# EAGLE design megapci3 (EAGLE 6.6.0)
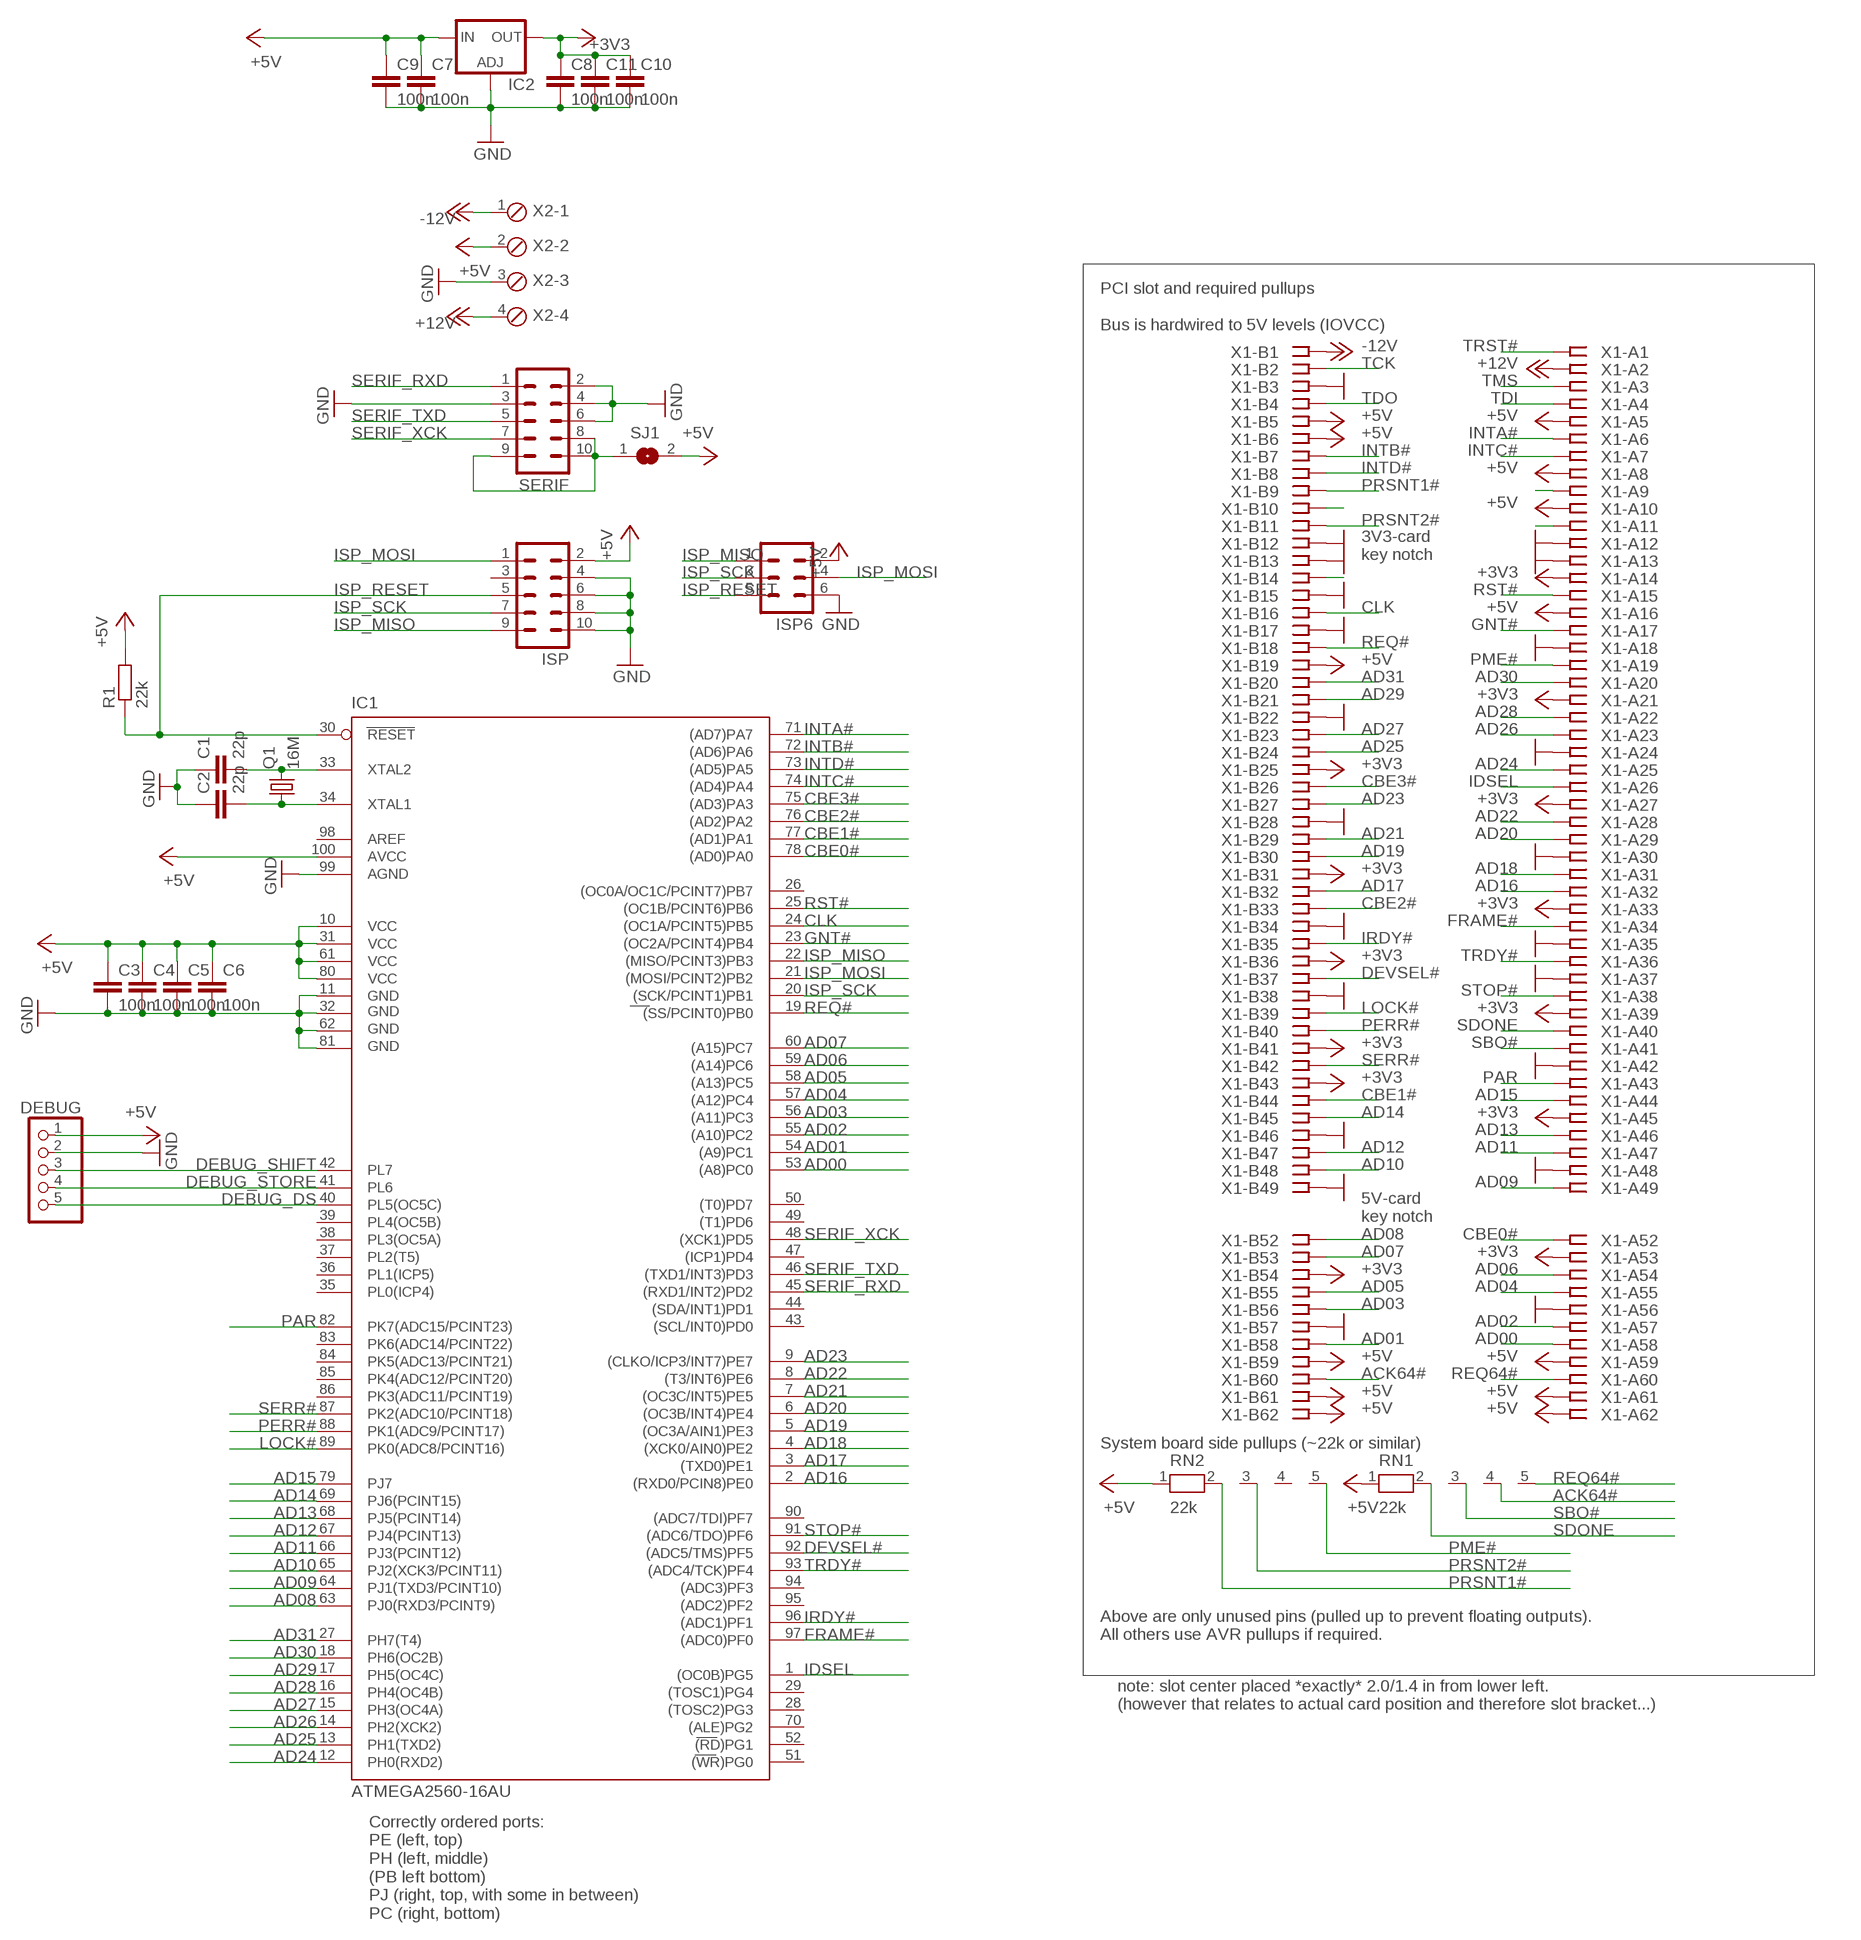
[diagram p0: schematic, sheet 1]

## Parts
C1  22p  C-EUC0805  [C0805]
C2  22p  C-EUC0805  [C0805]
C3  100n  C-EUC0805  [C0805]
C4  100n  C-EUC0805  [C0805]
C5  100n  C-EUC0805  [C0805]
C6  100n  C-EUC0805  [C0805]
C7  100n  C-EUC0805  [C0805]
C8  100n  C-EUC0805  [C0805]
C9  100n  C-EUC0805  [C0805]
C10  100n  C-EUC0805  [C0805]
C11  100n  C-EUC0805  [C0805]
DEBUG  PINHD-1X5  [1X05]
IC1  ATMEGA2560-16AU  [TQFP100]
IC2  LM317TS  [317TS]
ISP  ML10  [ML10]
ISP6  ML6  [ML6]
Q1  16M  CRYSTALHC49S  [HC49/S]
R1  22k  R-EU_R0805  [R0805]
RN1  22k  RN04  [RN-5]
RN2  22k  RN04  [RN-5]
SERIF  ML10  [ML10]
SJ1  SJ  [SJ]
X1  PCI-SLOT  [CON-PCI]
X2  MPT4  [4POL254]

## Nets
5V-SER: SERIF.8 SERIF.9 SERIF.10 SJ1.1
+3V3: C8.1 C10.1 C11.1 IC2.2(OUT) X1.A14 X1.A21 X1.A27 X1.A33 X1.A39 X1.A45 X1.A53 X1.B25 X1.B31 X1.B36 X1.B41 X1.B43 X1.B54
+5V: C3.1 C4.1 C5.1 C6.1 C7.1 C9.1 DEBUG.1 IC1.10(VCC) IC1.31(VCC1) IC1.61(VCC2) IC1.80(VCC3) IC1.100(AVCC) IC2.3(IN) ISP6.2 ISP.2 R1.2 RN1.1 RN2.1 SJ1.2 X1.A5 X1.A8 X1.A10 X1.A16 X1.A59 X1.A61 X1.A62 X1.B5 X1.B6 X1.B19 X1.B59 X1.B61 X1.B62 X2.2
+12V: X1.A2 X2.4
-12V: X1.B1 X2.1
ACK64#: RN1.4 X1.B60
AD00: IC1.53((A8)PC0) X1.A58
AD01: IC1.54((A9)PC1) X1.B58
AD02: IC1.55((A10)PC2) X1.A57
AD03: IC1.56((A11)PC3) X1.B56
AD04: IC1.57((A12)PC4) X1.A55
AD05: IC1.58((A13)PC5) X1.B55
AD06: IC1.59((A14)PC6) X1.A54
AD07: IC1.60((A15)PC7) X1.B53
AD08: IC1.63(PJ0(RXD3/PCINT9)) X1.B52
AD09: IC1.64(PJ1(TXD3/PCINT10)) X1.A49
AD10: IC1.65(PJ2(XCK3/PCINT11)) X1.B48
AD11: IC1.66(PJ3(PCINT12)) X1.A47
AD12: IC1.67(PJ4(PCINT13)) X1.B47
AD13: IC1.68(PJ5(PCINT14)) X1.A46
AD14: IC1.69(PJ6(PCINT15)) X1.B45
AD15: IC1.79(PJ7) X1.A44
AD16: IC1.2((RXD0/PCIN8)PE0) X1.A32
AD17: IC1.3((TXD0)PE1) X1.B32
AD18: IC1.4((XCK0/AIN0)PE2) X1.A31
AD19: IC1.5((OC3A/AIN1)PE3) X1.B30
AD20: IC1.6((OC3B/INT4)PE4) X1.A29
AD21: IC1.7((OC3C/INT5)PE5) X1.B29
AD22: IC1.8((T3/INT6)PE6) X1.A28
AD23: IC1.9((CLKO/ICP3/INT7)PE7) X1.B27
AD24: IC1.12(PH0(RXD2)) X1.A25
AD25: IC1.13(PH1(TXD2)) X1.B24
AD26: IC1.14(PH2(XCK2)) X1.A23
AD27: IC1.15(PH3(OC4A)) X1.B23
AD28: IC1.16(PH4(OC4B)) X1.A22
AD29: IC1.17(PH5(OC4C)) X1.B21
AD30: IC1.18(PH6(OC2B)) X1.A20
AD31: IC1.27(PH7(T4)) X1.B20
CBE0#: IC1.78((AD0)PA0) X1.A52
CBE1#: IC1.77((AD1)PA1) X1.B44
CBE2#: IC1.76((AD2)PA2) X1.B33
CBE3#: IC1.75((AD3)PA3) X1.B26
CLK: IC1.24((OC1A/PCINT5)PB5) X1.B16
DEBUG_DS: DEBUG.5 IC1.40(PL5(OC5C))
DEBUG_SHIFT: DEBUG.3 IC1.42(PL7)
DEBUG_STORE: DEBUG.4 IC1.41(PL6)
DEVSEL#: IC1.92((ADC5/TMS)PF5) X1.B37
FRAME#: IC1.97((ADC0)PF0) X1.A34
GND: C1.1 C2.1 C3.2 C4.2 C5.2 C6.2 C7.2 C8.2 C9.2 C10.2 C11.2 DEBUG.2 IC1.11(GND) IC1.32(GND1) IC1.62(GND2) IC1.81(GND3) IC1.99(AGND) IC2.1(ADJ) ISP6.6 ISP.4 ISP.6 ISP.8 ISP.10 SERIF.2 SERIF.3 SERIF.4 SERIF.6 X1.A12 X1.A13 X1.A18 X1.A24 X1.A30 X1.A35 X1.A37 X1.A42 X1.A48 X1.A56 X1.B3 X1.B12 X1.B13 X1.B15 X1.B17 X1.B22 X1.B28 X1.B34 X1.B38 X1.B46 X1.B49 X1.B57 X2.3
GNT#: IC1.23((OC2A/PCINT4)PB4) X1.A17
IDSEL: IC1.1((OC0B)PG5) X1.A26
INTA#: IC1.71((AD7)PA7) X1.A6
INTB#: IC1.72((AD6)PA6) X1.B7
INTC#: IC1.74((AD4)PA4) X1.A7
INTD#: IC1.73((AD5)PA5) X1.B8
IRDY#: IC1.96((ADC1)PF1) X1.B35
ISP_MISO: IC1.22((MISO/PCINT3)PB3) ISP6.1 ISP.9
ISP_MOSI: IC1.21((MOSI/PCINT2)PB2) ISP6.4 ISP.1
ISP_RESET: IC1.30(RESET) ISP6.5 ISP.5 R1.1
ISP_SCK: IC1.20((SCK/PCINT1)PB1) ISP6.3 ISP.7
LOCK#: IC1.89(PK0(ADC8/PCINT16)) X1.B39
N$4: C1.2 IC1.33(XTAL2) Q1.2
N$5: C2.2 IC1.34(XTAL1) Q1.1
PAR: IC1.82(PK7(ADC15/PCINT23)) X1.A43
PERR#: IC1.88(PK1(ADC9/PCINT17)) X1.B40
PME#: RN2.5 X1.A19
PRSNT1#: RN2.2 X1.B9
PRSNT2#: RN2.3 X1.B11
REQ64#: RN1.5 X1.A60
REQ#: IC1.19((SS/PCINT0)PB0) X1.B18
RST#: IC1.25((OC1B/PCINT6)PB6) X1.A15
RSVD1: X1.A9
RSVD2: X1.A11
RSVD3: X1.B10
RSVD4: X1.B14
SBO#: RN1.3 X1.A41
SDONE: RN1.2 X1.A40
SERIF_RXD: IC1.45((RXD1/INT2)PD2) SERIF.1
SERIF_TXD: IC1.46((TXD1/INT3)PD3) SERIF.5
SERIF_XCK: IC1.48((XCK1)PD5) SERIF.7
SERR#: IC1.87(PK2(ADC10/PCINT18)) X1.B42
STOP#: IC1.91((ADC6/TDO)PF6) X1.A38
TCK: X1.B2
TDI: X1.A4
TDO: X1.B4
TMS: X1.A3
TRDY#: IC1.93((ADC4/TCK)PF4) X1.A36
TRST#: X1.A1
Unconnected: IC1.26((OC0A/OC1C/PCINT7)PB7) IC1.28((TOSC2)PG3) IC1.29((TOSC1)PG4) IC1.35(PL0(ICP4)) IC1.36(PL1(ICP5)) IC1.37(PL2(T5)) IC1.38(PL3(OC5A)) IC1.39(PL4(OC5B)) IC1.43((SCL/INT0)PD0) IC1.44((SDA/INT1)PD1) IC1.47((ICP1)PD4) IC1.49((T1)PD6) IC1.50((T0)PD7) IC1.51((WR)PG0) IC1.52((RD)PG1) IC1.70((ALE)PG2) IC1.83(PK6(ADC14/PCINT22)) IC1.84(PK5(ADC13/PCINT21)) IC1.85(PK4(ADC12/PCINT20)) IC1.86(PK3(ADC11/PCINT19)) IC1.90((ADC7/TDI)PF7) IC1.94((ADC3)PF3) IC1.95((ADC2)PF2) IC1.98(AREF) ISP.3 RN2.4

## Notes on the sheet
- PCI slot and required pullups
  
  Bus is hardwired to 5V levels (IOVCC)
- 3V3-card
  key notch
- 5V-card
  key notch
- System board side pullups (~22k or similar)
- Above are only unused pins (pulled up to prevent floating outputs).
  All others use AVR pullups if required.
- note: slot center placed *exactly* 2.0/1.4 in from lower left.
  (however that relates to actual card position and therefore slot bracket...)
- Correctly ordered ports:
  PE (left, top)
  PH (left, middle)
  (PB left bottom)
  PJ (right, top, with some in between)
  PC (right, bottom)

## Library data of the parts
C1-C11 = rcl:C-EU: CAPACITOR, European symbol
DEBUG = pinhead:PINHD-1X5: PIN HEADER
IC1 = atmel-2005:ATMEGA*: MICROCONTROLLER 64/128/256 Kbytes FLASH 4 Kbytes EEPROM 8 Kbytes SRAM 86 General Purpose I/O pins 12-channels16-bit PWM 4 x Serial USARTs 16-channels 10-bit A/D
IC2 = v-reg:LM317TS: VOLTAGE REGULATOR
ISP SERIF = con-harting-mod:ML10: HARTING; OC_FARNELL: unknown; OC_NEWARK: unknown
ISP6 = con-harting-mod:ML6: HARTING; OC_FARNELL: unknown; OC_NEWARK: unknown
Q1 = crystal:CRYSTAL: CRYSTAL; OC_FARNELL: 1667008; OC_NEWARK: unknown
R1 = rcl:R-EU_: RESISTOR, European symbol
RN1 RN2 = resistor-net:RN04: RESISTOR NETWORK; OC_FARNELL: unknown; OC_NEWARK: unknown
SJ1 = jumper:SJ: SMD solder JUMPER
X1 = con-pc:PCI-SLOT: PCI SLOT
X2 = con-phoenix-254:MPT4: PHOENIX CONNECTOR; OC_FARNELL: unknown; OC_NEWARK: unknown

## Board
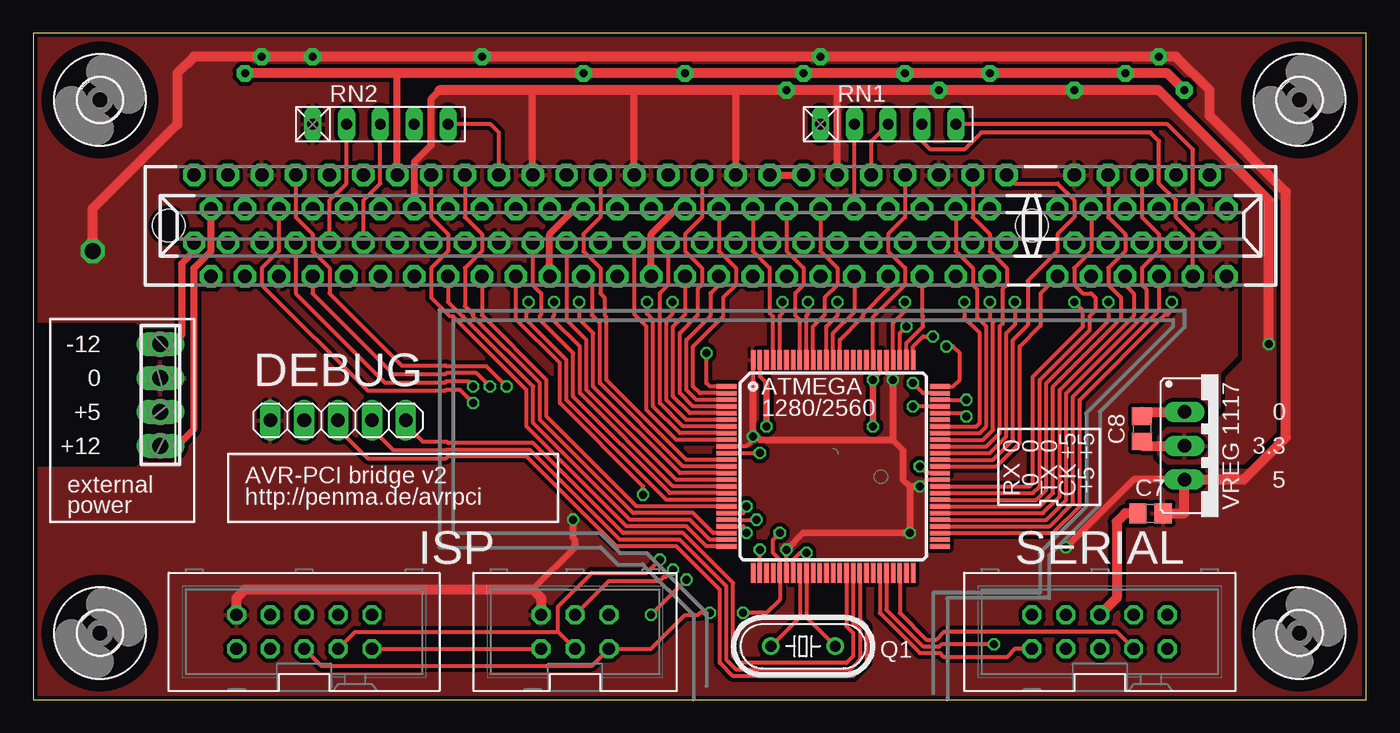
[diagram p1: board, top side]
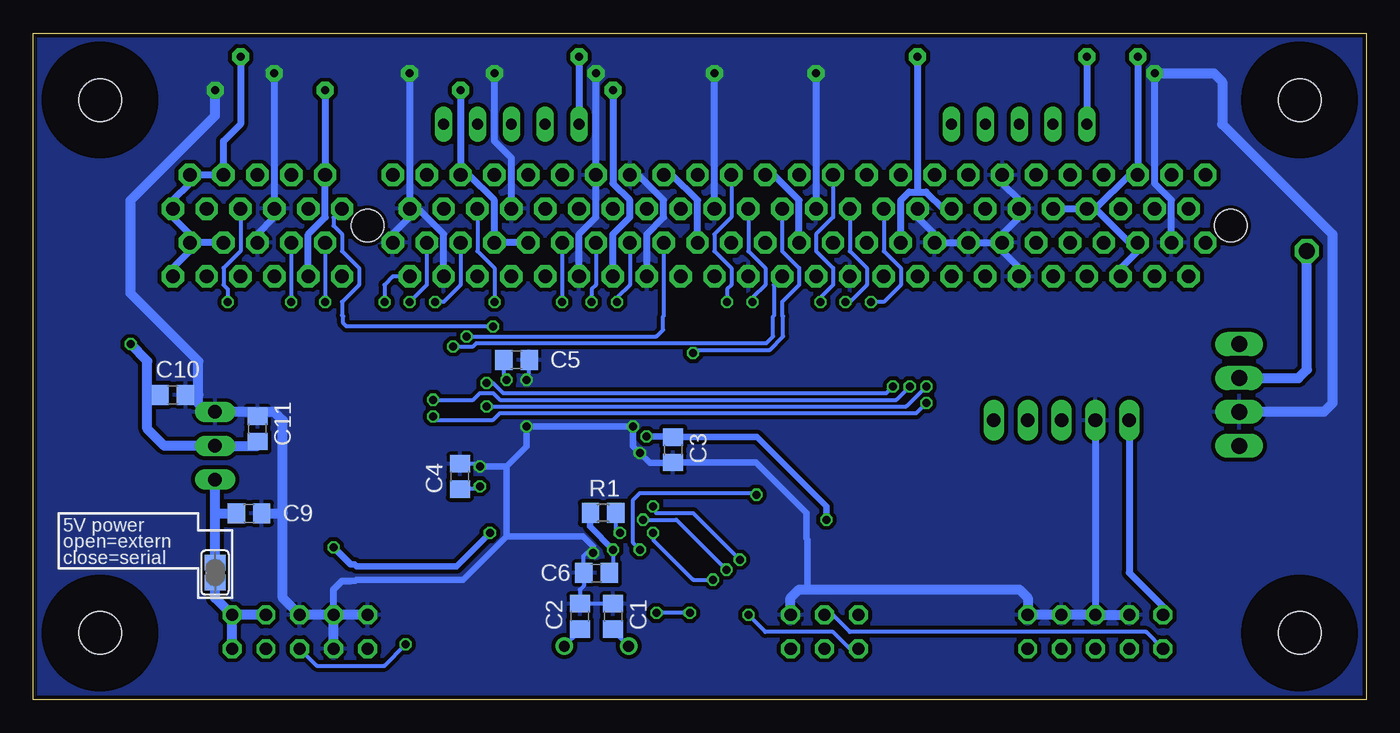
[diagram p2: board, bottom side, seen from below]

Size 100 x 50 mm. Coordinates in mm from the lower left corner, seen from the top.
Outline: 0,0 100,0 100,50 0,50 0,0
Copper layers (1*16): Top 0.035mm / dielectric 1.5mm / Bottom 0.035mm
Design rules "dirt_cheap_dirty_boards.v1 *": minimum track width 5mil, minimum drill 12mil, track to track 5mil, track to pad 5mil, pad to pad 5mil, via to via 5mil, smd to smd 0mil, copper to edge 10mil, drill to drill 10mil, minimum pad ring 10mil, minimum via ring 6mil, stop-mask expansion 1mil, vias tented up to drill 25mil, thermal gap 10mil
tRestrict: area 0,17.8 to 7.6,27.9

### Footprints (pad centres in the part's own frame; a part is rotated, then mirrored left to right if it is on the bottom)
C0805 = smd 1.3 x 1.5: 1 -0.95,0; 2 0.95,0
1X05 = drill 1.016 long: 1 -5.08,0; 2 -2.54,0; 3 0,0; 4 2.54,0; 5 5.08,0
TQFP100 = smd 1.5 x 0.35: 1 -8,6; 2 -8,5.5; 3 -8,5; 4 -8,4.5; 5 -8,4; 6 -8,3.5; 7 -8,3; 8 -8,2.5; 9 -8,2; 10 -8,1.5; 11 -8,1; 12 -8,0.5; 13 -8,0; 14 -8,-0.5; 15 -8,-1; 16 -8,-1.5; 17 -8,-2; 18 -8,-2.5; 19 -8,-3; 20 -8,-3.5; 21 -8,-4; 22 -8,-4.5; 23 -8,-5; 24 -8,-5.5; 25 -8,-6; 51 8,-6; 52 8,-5.5; 53 8,-5; 54 8,-4.5; 55 8,-4; 56 8,-3.5; 57 8,-3; 58 8,-2.5; 59 8,-2; 60 8,-1.5; 61 8,-1; 62 8,-0.5; 63 8,0; 64 8,0.5; 65 8,1; 66 8,1.5; 67 8,2; 68 8,2.5; 69 8,3; 70 8,3.5; 71 8,4; 72 8,4.5; 73 8,5; 74 8,5.5; 75 8,6 | smd 0.35 x 1.5: 26 -6,-8; 27 -5.5,-8; 28 -5,-8; 29 -4.5,-8; 30 -4,-8; 31 -3.5,-8; 32 -3,-8; 33 -2.5,-8; 34 -2,-8; 35 -1.5,-8; 36 -1,-8; 37 -0.5,-8; 38 0,-8; 39 0.5,-8; 40 1,-8; 41 1.5,-8; 42 2,-8; 43 2.5,-8; 44 3,-8; 45 3.5,-8; 46 4,-8; 47 4.5,-8; 48 5,-8; 49 5.5,-8; 50 6,-8; 76 6,8; 77 5.5,8; 78 5,8; 79 4.5,8; 80 4,8; 81 3.5,8; 82 3,8; 83 2.5,8; 84 2,8; 85 1.5,8; 86 1,8; 87 0.5,8; 88 0,8; 89 -0.5,8; 90 -1,8; 91 -1.5,8; 92 -2,8; 93 -2.5,8; 94 -3,8; 95 -3.5,8; 96 -4,8; 97 -4.5,8; 98 -5,8; 99 -5.5,8; 100 -6,8
317TS = drill 1.016 long: 1 -2.54,-2.54; 2 0,-2.54; 3 2.54,-2.54
ML10 = drill 0.914 octagon: 1 -5.08,-1.27; 2 -5.08,1.27; 3 -2.54,-1.27; 4 -2.54,1.27; 5 0,-1.27; 6 0,1.27; 7 2.54,-1.27; 8 2.54,1.27; 9 5.08,-1.27; 10 5.08,1.27
ML6 = drill 0.914 octagon: 1 -2.54,-1.27; 2 -2.54,1.27; 3 0,-1.27; 4 0,1.27; 5 2.54,-1.27; 6 2.54,1.27
HC49/S = drill 0.813: 1 -2.413,0; 2 2.413,0
R0805 = smd 1.3 x 1.5: 1 -0.95,0; 2 0.95,0
RN-5 = drill 0.813 long: 1 -5.08,0; 2 -2.54,0; 3 0,0; 4 2.54,0; 5 5.08,0
SJ = smd 1.168 x 1.6: 1 -0.762,0; 2 0.762,0
3,2 = hole 3.2: 0,0
CON-PCI = drill 1.016 pad 1.676 octagon: A1 -38.735,3.81; A2 -37.465,1.27; A3 -36.195,3.81; A4 -34.925,1.27; A5 -33.655,3.81; A6 -32.385,1.27; A7 -31.115,3.81; A8 -29.845,1.27; A9 -28.575,3.81; A10 -27.305,1.27; A11 -26.035,3.81; A12 -24.765,1.27; A13 -23.495,3.81; A14 -22.225,1.27; A15 -20.955,3.81; A16 -19.685,1.27; A17 -18.415,3.81; A18 -17.145,1.27; A19 -15.875,3.81; A20 -14.605,1.27; A21 -13.335,3.81; A22 -12.065,1.27; A23 -10.795,3.81; A24 -9.525,1.27; A25 -8.255,3.81; A26 -6.985,1.27; A27 -5.715,3.81; A28 -4.445,1.27; A29 -3.175,3.81; A30 -1.905,1.27; A31 -0.635,3.81; A32 0.635,1.27; A33 1.905,3.81; A34 3.175,1.27; A35 4.445,3.81; A36 5.715,1.27; A37 6.985,3.81; A38 8.255,1.27; A39 9.525,3.81; A40 10.795,1.27; A41 12.065,3.81; A42 13.335,1.27; A43 14.605,3.81; A44 15.875,1.27; A45 17.145,3.81; A46 18.415,1.27; A47 19.685,3.81; A48 20.955,1.27; A49 22.225,3.81; A52 26.035,1.27; A53 27.305,3.81; A54 28.575,1.27; A55 29.845,3.81; A56 31.115,1.27; A57 32.385,3.81; A58 33.655,1.27; A59 34.925,3.81; A60 36.195,1.27; A61 37.465,3.81; A62 38.735,1.27; B1 -38.735,-1.27; B2 -37.465,-3.81; B3 -36.195,-1.27; B4 -34.925,-3.81; B5 -33.655,-1.27; B6 -32.385,-3.81; B7 -31.115,-1.27; B8 -29.845,-3.81; B9 -28.575,-1.27; B10 -27.305,-3.81; B11 -26.035,-1.27; B12 -24.765,-3.81; B13 -23.495,-1.27; B14 -22.225,-3.81; B15 -20.955,-1.27; B16 -19.685,-3.81; B17 -18.415,-1.27; B18 -17.145,-3.81; B19 -15.875,-1.27; B20 -14.605,-3.81; B21 -13.335,-1.27; B22 -12.065,-3.81; B23 -10.795,-1.27; B24 -9.525,-3.81; B25 -8.255,-1.27; B26 -6.985,-3.81; B27 -5.715,-1.27; B28 -4.445,-3.81; B29 -3.175,-1.27; B30 -1.905,-3.81; B31 -0.635,-1.27; B32 0.635,-3.81; B33 1.905,-1.27; B34 3.175,-3.81; B35 4.445,-1.27; B36 5.715,-3.81; B37 6.985,-1.27; B38 8.255,-3.81; B39 9.525,-1.27; B40 10.795,-3.81; B41 12.065,-1.27; B42 13.335,-3.81; B43 14.605,-1.27; B44 15.875,-3.81; B45 17.145,-1.27; B46 18.415,-3.81; B47 19.685,-1.27; B48 20.955,-3.81; B49 22.225,-1.27; B52 26.035,-3.81; B53 27.305,-1.27; B54 28.575,-3.81; B55 29.845,-1.27; B56 31.115,-3.81; B57 32.385,-1.27; B58 33.655,-3.81; B59 34.925,-1.27; B60 36.195,-3.81; B61 37.465,-1.27; B62 38.735,-3.81 | hole 2.438: 24.13,0; -40.64,0
4POL254 = drill 1.2 long: 1 -3.81,0; 2 -1.27,0; 3 1.27,0; 4 3.81,0

### Placement (x,y rotation side)
C1  56.5,6.25 270 bottom
C2  59,6.25 270 bottom
C3  52,18.75 270 bottom
C4  68,16.75 90 bottom
C5  63.75,25.5 0 bottom
C6  57.75,9.5 180 bottom
C7  83.82,13.97 180 top
C8  83.19,20.32 90 top
C9  83.82,13.97 0 bottom
C10  89.53,22.86 0 bottom
C11  83.19,20.32 90 bottom
DEBUG  22.86,20.95 0 top
IC1  60,17.5 0 top
IC2  88.9,19.05 270 top
ISP  20.32,5.08 0 top
ISP6  40.64,5.08 0 top
Q1  57.75,4 180 top
R1  57.25,14 180 bottom
RN1  64.14,43.18 0 top
RN2  26.04,43.18 0 top
SERIF  80.01,5.08 0 top
SJ1  86.36,9.53 90 bottom
U$1  [3,2]  5,5 0 top
U$2  [3,2]  5,45 0 top
U$3  [3,2]  95,45 0 top
U$4  [3,2]  95,5 0 top
X1  50.8,35.56 0 top
X2  9.53,22.86 270 top

### Tracks (layer width: path | path; a pad name or v marks a point on that pad's centre or on a via)
5V-SER
  Bottom 0.75: SERIF.9 SERIF.10 | SERIF.8 SERIF.10 | SERIF.10 86.36,7.62 SJ1.1
+3V3  (via drill 0.6, 0.6 pad 1.27)
  Top 0.508: X1.A14 28.57,40.32 29.84,41.59 29.84,45.09 30.48,45.72 | X1.A39 60.33,45.72 | X1.A33 52.7,45.72 | X1.A27 45.09,45.72 | X1.A21 37.47,45.72
  Top 0.75: C11.1 83.19,19.05 IC2.2 | v92.71,26.67 92.71,37.47 84.45,45.72 v78.11,45.72 v67.94,45.72 60.33,45.72 v56.52,45.72 52.7,45.72 45.09,45.72 37.47,45.72 30.48,45.72
  Bottom 0.508: X1.B41 X1.B43 65.41,37.47 67.31,39.37 X1.A45 v67.94,45.72 | X1.B54 79.38,34.92 78.11,36.2 X1.A53 v78.11,45.72 | X1.B36 56.52,34.92 55.24,36.2 55.24,37.47 56.52,38.73 v56.52,45.72 | X1.B31 50.16,37.47 52.07,39.37 X1.A33 | X1.B25 42.55,37.47 44.45,39.37 X1.A27
  Bottom 0.75: 91.44,22.86 91.44,20.32 90.17,19.05 IC2.2 83.19,19.05 C11.1 | 91.44,22.86 91.44,25.4 v92.71,26.67 | C10.1 91.44,22.86
  pour Top (isolate 0.305, rank 2): 30.48,45.72 29.84,45.09 29.84,41.59 28.57,40.32 28.57,38.1 89.53,38.1 90.81,36.83 90.81,25.4 89.53,24.13 89.53,21.59 88.27,20.32 85.09,20.32 84.45,19.68 84.45,18.41 85.09,17.78 90.81,17.78 93.34,20.32 93.34,36.83 84.45,45.72
+5V  (via drill 0.6, 0.6 pad 1.27, 1.2)
  Top 0.3: IC1.80 64,24.5 v64.5,24 | IC1.61 67,16.5 v66.5,16 | IC1.31 v56.5,11.25 | v54,19.75 54,19.5 53.5,19 IC1.10 | IC1.100 54,23.75
  Top 0.5: v64.5,24 64.5,19.5 | 54,23.75 v54,19.75 54.25,19.75 54.5,19.5 64.5,19.5 | v66.5,16 65.75,16 | 65.75,16 v65.75,12.5 57.75,12.5 v56.5,11.25 | 65.75,16 65.25,16.5 65.25,18.75 64.5,19.5 | v40.5,13.5 40.5,12.14 40.64,12 40.64,11.43 37.47,8.26
  Top 0.508: IC2.3 82.55,16.51 v77.47,11.43
  Top 0.75: C9.1 86.36,13.97 IC2.3 90.81,16.51 93.98,19.68 93.98,38.1 88.27,43.81 88.27,45.72 85.72,48.26 v84.45,48.26 v59.05,48.26 v33.66,48.26 v20.95,48.26 v17.14,48.26 12.06,48.26 10.79,46.99 10.79,43.18 4.45,36.83 v4.45,33.66 | ISP.2 15.24,7.62 15.88,8.26 37.47,8.26 38.1,7.62 ISP6.2
  Bottom 0.3: v64.5,24 64.7,24.2 C5.1 | v66.5,16 66.7,15.8 C4.1 | v56.5,11.25 56.5,9.8 C6.1
  Bottom 0.5: 76.2,10.16 75.91,10.16 75.75,10 68.25,10 v65.75,12.5 | v54,19.75 52.05,19.75 C3.1 45.7,19.7 40.5,14.5 v40.5,13.5 | v56.5,11.25 58.25,13 58.25,13.95 R1.2
  Bottom 0.508: X1.B61 88.27,34.92 89.53,36.2 X1.A62 89.53,37.47 88.27,38.73 X1.A61 X1.A59 85.72,41.91 84.45,43.18 v84.45,48.26 | X1.B62 89.53,32.38 88.27,33.66 X1.B61 | X1.B59 X1.B61 | X1.A10 X1.A8 20.32,36.83 | X1.B6 18.41,32.38 17.14,33.66 X1.B5 17.78,34.29 20.32,36.83 | 20.32,36.83 17.78,39.37 X1.A5 v17.14,48.26 | X1.B19 34.92,37.47 34.29,38.1 33.66,38.1 | 33.66,38.1 33.02,38.1 31.75,36.83 X1.A16 | v33.66,48.26 33.66,38.1 | v20.95,48.26 RN2.1 | v59.05,48.26 RN1.1 | v77.47,11.43 76.2,10.16 | DEBUG.1 17.78,9.53 15.24,6.99 ISP.2
  Bottom 0.75: SJ1.2 86.36,13.97 | 86.36,13.97 IC2.3 | 86.36,13.97 C9.1 | X2.2 5.08,24.13 4.45,24.77 v4.45,33.66
  pour Top (isolate 0.3, rank 6): 0,0 100,0 100,50 99.75,50 0,50
+12V
  Top 0.508: X2.4 10.79,19.05 12.06,20.32 12.06,32.38 13.34,33.66 X1.A2
-12V
  Top 0.508: X1.B1 12.06,33.66 11.11,32.7 11.11,27.3 10.48,26.67 X2.1
ACK64#
  Top 0.3: X1.B60 87,34.92 85.72,36.2 85.72,37.47 84.45,38.73 84.45,41.91 83.82,42.55 71.12,42.55 69.85,41.27 67.31,41.27 66.67,41.91 RN1.4
AD00  (via drill 0.6)
  Top 0.3: IC1.53 76.5,12.5 78.5,14.5 78.5,22.5 84.89,28.89 85.09,28.89 85.41,29.21 v85.41,29.84
  Bottom 0.3: X1.A58 84.45,33.66 85.72,32.38 85.72,31.11 85.41,30.8 v85.41,29.84
AD01
  Top 0.3: X1.B58 84.45,29.2 78,22.75 78,14.75 76.25,13 IC1.54
AD02
  Top 0.3: X1.A57 83.19,36.2 84.45,34.92 84.45,33.66 83.19,32.38 83.19,31.11 83.5,30.8 83.5,29 77.5,23 77.5,15 76,13.5 IC1.55
AD03
  Top 0.3: X1.B56 81.92,31.11 82.55,30.48 82.55,28.8 77,23.25 77,15.25 75.75,14 IC1.56
AD04
  Top 0.3: X1.A55 80.64,36.2 81.92,34.92 81.92,33.66 80.64,32.38 80.64,31.11 81.6,30.16 81.6,28.6 76.5,23.5 76.5,15.5 75.5,14.5 IC1.57
AD05  (via drill 0.6)
  Top 0.3: v80.64,29.84 80.64,28.39 76,23.75 76,15.75 75.25,15 IC1.58
  Bottom 0.3: X1.B55 v80.64,29.84
AD06
  Top 0.3: X1.A54 79.38,33.66 78.11,32.38 78.11,31.11 78.74,30.48 79.38,30.48 79.69,30.16 79.69,29.21 79.25,28.77 79.25,27.75 75.5,24 75.5,16 75,15.5 IC1.59
AD07  (via drill 0.6)
  Top 0.3: v78.11,29.84 78.75,29.2 78.75,28 75,24.25 75,16.25 74.75,16 IC1.60
  Bottom 0.3: X1.B53 v78.11,29.84
AD08
  Top 0.3: X1.B52 75.56,30.48 75.56,28.07 74,26.5 74,19.25 72.25,17.5 IC1.63
AD09
  Top 0.3: X1.A49 73.66,38.73 76.83,38.73 78.11,37.47 78.11,36.2 76.83,34.92 76.83,33.66 74.61,31.43 74.61,28.11 73.5,27 73.5,19.5 72,18 IC1.64
AD10  (via drill 0.6)
  Top 0.3: v73.66,29.84 73.66,28.16 73,27.5 73,19.75 71.75,18.5 IC1.65
  Bottom 0.3: X1.B48 73.03,31.75 73.66,31.11 v73.66,29.84
AD11
  Top 0.3: X1.A47 70.48,36.2 71.75,34.92 71.75,33.66 73.03,32.38 73.03,31.11 72.71,30.8 72.71,28.21 72.5,28 72.5,20 71.5,19 IC1.66
AD12  (via drill 0.6)
  Top 0.3: v71.75,29.84 71.75,28.57 72,28.33 72,20.25 71.25,19.5 IC1.67
  Bottom 0.3: X1.B47 70.48,31.11 v71.75,29.84
AD13
  Top 0.3: X1.A46 69.22,33.66 70.48,32.38 70.48,31.11 70.8,30.8 70.8,28.7 71.5,28 71.5,20.5 71,20 IC1.68
AD14  (via drill 0.6)
  Top 0.3: v69.85,29.84 69.85,28.65 71,27.5 71,20.75 70.75,20.5 IC1.69
  Bottom 0.3: X1.B45 67.94,31.11 69.22,29.84 v69.85,29.84
AD15  (via drill 0.6)
  Top 0.3: v65.41,29.84 65.41,29.16 64.5,28.25 IC1.79
  Bottom 0.3: X1.A44 66.67,33.66 65.41,32.38 v65.41,29.84
AD16
  Top 0.3: IC1.2 50,23 49.5,23.5 49.5,26.5 51.75,28.75 51.75,30.16 52.7,31.11 52.7,32.38 51.44,33.66 X1.A32
AD17
  Top 0.3: X1.B32 51.44,31.11 50.8,30.48 50.8,28.8 49,27 49,23.25 49.75,22.5 IC1.3
AD18
  Top 0.3: X1.A31 50.16,36.2 48.9,34.92 48.9,33.66 50.16,32.38 50.16,31.11 49.85,30.8 49.85,28.85 48.5,27.5 48.5,23 49.5,22 IC1.4
AD19
  Top 0.3: IC1.5 49.25,21.5 48,22.75 48,28 48.9,28.89 X1.B30
AD20  (via drill 0.6)
  Top 0.3: IC1.6 49,21 47.5,22.5 47.5,28.5 47.94,28.94 v47.94,29.84
  Bottom 0.3: X1.A29 47.62,36.2 48.9,34.92 48.9,33.66 47.62,32.38 47.62,31.11 47.94,30.8 v47.94,29.84
AD21
  Top 0.3: IC1.7 48.75,20.5 47,22.25 47,28.75 46.99,28.76 46.99,30.48 47.62,31.11 X1.B29
AD22  (via drill 0.6)
  Top 0.3: IC1.8 48.5,20 46.5,22 46.5,28.5 46.04,28.96 v46.04,29.84
  Bottom 0.3: X1.A28 46.35,33.66 45.09,32.38 45.09,31.11 46.04,30.16 v46.04,29.84
AD23
  Top 0.3: IC1.9 48.25,19.5 46,21.75 46,28 45.09,28.91 X1.B27
AD24
  Top 0.3: IC1.12 49,18 43,24 43,28.73 42.86,28.86 42.86,30.16 42.55,30.48 42.55,32.38 41.27,33.66 41.27,34.92 42.55,36.2 X1.A25
AD25
  Top 0.3: IC1.13 48.75,17.5 42.5,23.75 42.5,28.25 41.91,28.84 41.91,31.11 X1.B24
AD26  (via drill 0.6)
  Top 0.3: IC1.14 48.5,17 42,23.5 42,27.5 40.96,28.54 v40.96,29.84
  Bottom 0.3: X1.A23 40.01,36.2 41.27,34.92 41.27,33.66 40.01,32.38 40.01,31.11 40.96,30.16 v40.96,29.84
AD27
  Top 0.3: IC1.15 48.25,16.5 41.5,23.25 41.5,27 40,28.5 40.01,28.5 X1.B23
AD28  (via drill 0.6)
  Top 0.3: IC1.16 48,16 41,23 41,26.5 39,28.5 39,28.75 39.05,28.8 v39.05,29.84
  Bottom 0.3: X1.A22 38.73,33.66 37.47,32.38 37.47,31.11 38.73,29.84 v39.05,29.84
AD29
  Top 0.3: IC1.17 47.75,15.5 40.5,22.75 40.5,26 38,28.5 38,28.8 38.1,28.9 38.1,30.48 37.47,31.11 X1.B21
AD30  (via drill 0.6)
  Top 0.3: IC1.18 47.5,15 40,22.5 40,25.5 37,28.5 37,29.02 37.15,29.17 v37.15,29.84
  Bottom 0.3: X1.A20 36.2,33.66 34.92,32.38 34.92,31.11 36.2,29.84 v37.15,29.84
AD31  (via drill 0.6)
  Top 0.3: X1.B20 36.2,28.55 39.5,25.25 39.5,22.25 45.75,16 v45.75,15.38 | IC1.27 v54.5,11.25
  Bottom 0.3: v54.5,11.25 55,11.75 55,15 54.5,15.5 46,15.5 45.88,15.38 v45.75,15.38
CBE0#  (via drill 0.6)
  Top 0.3: IC1.78 65,27.5 v65.5,28
  Bottom 0.3: X1.A52 77.47,36.2 77.47,35.56 76.83,34.92 76.83,33.66 75.56,32.38 75.56,31.11 76.83,29.84 76.83,28.84 76.75,28.75 76.75,28.25 76.5,28 v65.5,28
CBE1#
  Top 0.3: IC1.77 65.5,26.75 66.75,28 66.75,28.75 66.67,28.82 X1.B44
CBE2#  (via drill 0.6)
  Top 0.3: IC1.76 66,26.5 66.75,27.25 v67.5,27.25
  Bottom 0.3: X1.B33 52.7,28.8 52.75,28.75 52.75,27.75 53.25,27.25 v67.5,27.25
CBE3#  (via drill 0.6)
  Top 0.3: IC1.75 69,23.5 69.5,24 69.5,26 69,26.5 v68.5,26.5
  Bottom 0.3: v68.5,26.5 67,26.5 66.75,26.75 45,26.75 44.5,27.25 44.5,28.75 44.45,28.8 44.45,31.11 X1.B26
CLK
  Top 0.3: X1.B16 31.11,29.84 32.21,28.75 32.25,28.75 37.5,23.5 37.5,20.75 44.75,13.5 49.25,13.5 50.75,12 IC1.24
DEBUG_DS
  Top 0.3: IC1.40 61,5.5 61.5,5 61.5,3.25 61,2.75 53,2.75 52.5,3.25 52.5,8.75 48.75,12.5 44.25,12.5 37.5,19.25 31.12,19.25 31.01,19.37 29.21,19.37 27.94,20.64 DEBUG.5
DEBUG_SHIFT
  Top 0.3: IC1.42 62,6 62.5,5.5 62.5,2.75 61.5,1.75 52.5,1.75 51.5,2.75 51.5,8.25 48.25,11.5 43.75,11.5 37,18.25 31.12,18.25 30.97,18.1 25.08,18.1 22.86,20.32 DEBUG.3
DEBUG_STORE
  Top 0.3: IC1.41 61.5,5.75 62,5.25 62,3 61.25,2.25 52.75,2.25 52,3 52,8.5 48.5,12 44,12 37.25,18.75 31,18.75 30.98,18.73 26.99,18.73 25.4,20.32 DEBUG.4
DEVSEL#  (via drill 0.6)
  Top 0.3: v58.1,29.84 58.1,28.9 58,28.8 IC1.92
  Bottom 0.3: X1.B37 57.78,31.11 58.1,30.8 v58.1,29.84
FRAME#
  Top 0.3: X1.A34 53.98,33.66 55.24,32.38 55.24,29 55.5,28.75 IC1.97
GND  (via drill 0.6, 0.6 pad 1.27)
  Top 0.3: IC1.81 63.5,24.5 v63,24 | IC1.62 67,17 v66.5,17.5 | IC1.32 57,10.5 57.5,11 v58,11 | IC1.11 v54.5,18.5 | IC1.99 54.5,24.25 55,23.75
  Top 0.5: v63,24 v63,20.5 | 55,23.75 v55,20.5
  Top 0.508: X1.A35 X1.A37 | X1.B22 38.73,34.92 40.64,36.83 X1.A24 | X1.B28 46.35,34.92 48.26,36.83 X1.A30 | X1.A13 27.3,46.99
  Top 0.75: C11.2 83.19,21.59 IC2.1 | C9.2 81.92,13.97 81.28,13.34 81.28,7.62 SERIF.6 | v86.36,45.72 85.09,46.99 v81.92,46.99 v71.75,46.99 v65.41,46.99 v57.78,46.99 v48.9,46.99 v41.27,46.99 27.3,46.99 v15.88,46.99
  Bottom 0.3: C1.1 C2.1 59,8.25 58.7,8.55 C6.2 58.75,9.55 58.75,10.75 58.5,11 v58,11 | 67.95,17.75 C4.2 66.7,17.7 v66.5,17.5 | v63,24 62.8,24.2 C5.2
  Bottom 0.5: 76.2,8.89 75.86,8.89 75.75,9 67.75,9 64.5,12.25 | 64.5,12.25 58.75,12.25 58,11.5 v58,11 | 64.5,12.25 64.5,17.5 | 64.5,17.5 v66.5,17.5 | 64.5,17.5 63,19 v63,20.5 v55,20.5 55,19 v54.5,18.5 53.75,17.75 52.05,17.75 C3.2 45.8,17.8 42,14 42,12.09 41.91,12 41.91,8.26
  Bottom 0.508: X1.B46 69.22,34.92 71.12,36.83 X1.A48 | X1.B49 73.03,34.92 71.75,36.2 X1.A48 | X1.B57 83.19,34.92 81.92,36.2 X1.A56 v81.92,46.99 | X1.B38 59.05,34.92 57.78,36.2 X1.A37 v57.78,46.99 | X1.A42 64.14,40.64 65.41,41.91 v65.41,46.99 | X1.B34 53.98,34.92 52.7,36.2 52.7,37.47 54.61,39.37 X1.A35 | X1.B13 X1.B15 X1.B17 32.38,34.92 33.66,36.2 X1.A18 | X1.B12 26.04,32.38 27.3,33.66 X1.B13 | X1.B13 27.3,34.92 26.04,36.2 X1.A12 26.04,37.47 27.3,38.73 X1.A13 | X1.B3 14.61,37.47 15.88,38.73 v15.88,46.99 | v41.27,46.99 X1.A24 | X1.A30 v48.9,46.99 | v71.75,46.99 X1.A48 | SERIF.4 77.47,8.26 76.83,8.89 76.2,8.89 | DEBUG.2 ISP.6
  Bottom 0.75: SERIF.3 SERIF.4 | SERIF.2 SERIF.4 | SERIF.4 SERIF.6 81.28,7.62 81.28,13.97 | 81.28,13.97 81.28,20.95 81.92,21.59 83.19,21.59 | C9.2 81.28,13.97 | 83.19,21.59 IC2.1 87,21.59 87.63,22.23 87.63,22.86 | C11.2 83.19,21.59 | 87.63,22.86 87.63,25.4 92.71,30.48 92.71,37.47 86.36,43.81 v86.36,45.72 | C10.2 87.63,22.86 | ISP.4 ISP.6 ISP.8 ISP.10 25.4,7.62 26.04,8.26 41.91,8.26 42.55,8.26 43.18,7.62 ISP6.6 | v15.88,46.99 11.43,46.99 10.79,46.35 10.79,43.18 2.54,34.92 2.54,22.23 3.17,21.59 X2.3
  pour Bottom (isolate 0.3): 0,0 100,0 100,50 0,50
GNT#
  Top 0.3: X1.A17 32.38,36.2 33.66,34.92 33.66,33.66 32.38,32.38 32.38,29.53 33,28.91 33,28.75 38,23.75 38,21 45,14 49.5,14 51,12.5 IC1.23
IDSEL  (via drill 0.6)
  Top 0.3: IC1.1 50.75,23.5 50.5,23.75 v50.5,26
  Bottom 0.3: X1.A26 43.81,33.66 42.55,32.38 42.55,31.11 43.81,29.84 43.81,28.82 43.75,28.75 43.75,27.25 44.75,26.25 50.25,26.25 v50.5,26
INTA#  (via drill 0.6)
  Top 0.3: X1.A6 18.41,33.66 17.14,32.38 17.14,31.11 25.08,23.18 30.93,23.18 31,23.25 32,23.25 v33,22.25 | IC1.71 69.75,21.5 v70,21.25
  Bottom 0.3: v70,21.25 69.75,21 65.5,21 65,21.5 33.75,21.5 v33,22.25
INTB#  (via drill 0.6)
  Top 0.3: X1.B7 19.68,30.48 26.35,23.81 30.94,23.81 31,23.88 32.62,23.88 v33,23.5 | IC1.72 v66,22
  Bottom 0.3: v66,22 34.5,22 v33,23.5
INTC#  (via drill 0.6)
  Top 0.3: X1.A7 19.68,36.2 20.95,34.92 20.95,33.66 22.23,32.38 22.23,30.48 27.62,25.08 30.92,25.08 31,25 34,25 v35.5,23.5 | IC1.74 66.75,23 v66,23.75
  Bottom 0.3: v66,23.75 65.5,23.75 64.75,23 36,23 v35.5,23.5
INTD#  (via drill 0.6)
  Top 0.3: X1.B8 20.95,30.48 26.99,24.45 30.95,24.45 31,24.5 33.25,24.5 v34.25,23.5 | IC1.73 v70,22.5
  Bottom 0.3: v70,22.5 67,22.5 66.5,23 65.5,23 65,22.5 35.25,22.5 v34.25,23.5
IRDY#  (via drill 0.6)
  Top 0.3: v56.2,29.84 56.2,29 56,28.8 IC1.96
  Bottom 0.3: X1.B35 55.24,31.11 56.2,30.16 v56.2,29.84
ISP_MISO  (via drill 0.6)
  Top 0.3: IC1.22 53.25,13 53.5,12.75 v53.5,12.5 | v46.35,6.35 48.26,8.26 v49,9 | ISP.9 ISP6.1
  Bottom 0.3: v53.5,12.5 53.5,12 50.5,9 v49,9 | ISP6.1 38.73,3.81 40.01,5.08 45.09,5.08 v46.35,6.35
ISP_MOSI  (via drill 0.6)
  Top 0.3: IC1.21 v54.25,13.5 | ISP6.4 43.18,8.89 46.99,8.89 47.31,9.21 47.46,9.21 v48,9.75
  Bottom 0.3: v54.25,13.5 51.75,13.5 v48,9.75 | ISP.1 16.51,5.08 38.73,5.08 40.01,6.35 ISP6.4
ISP_RESET  (via drill 0.6)
  Top 0.3: v56,12.5 55.5,12 55.5,11 56,10.5 IC1.30 56,7.5 55,6.5 v53.25,6.5 | v50.75,6.5 50,6.5 49.85,6.35 48.9,6.35 46.35,3.81 ISP6.5 41.91,2.54 21.59,2.54 ISP.5
  Bottom 0.3: v56,12.5 56.3,12.8 R1.1 | v50.75,6.5 v53.25,6.5
ISP_SCK  (via drill 0.6)
  Top 0.3: IC1.20 53.25,14 53.5,14.25 v53.5,14.5 | ISP6.3 39.37,5.08 | 39.37,5.08 39.37,6.99 41.91,9.53 46.04,9.53 46.35,9.84 46.35,9.86 v47,10.5 | ISP.7 24.13,5.08 39.37,5.08
  Bottom 0.3: v53.5,14.5 53.5,14.25 53.25,14 50.5,14 v47,10.5
LOCK#  (via drill 0.6)
  Top 0.3: v60.33,29.84 60.33,28.82 59.5,28 IC1.89
  Bottom 0.3: X1.B39 v60.33,29.84
N$4
  Top 0.3: IC1.33 57.5,6.16 Q1.2
  Bottom 0.3: Q1.2 56.5,5.16 C1.2
N$5
  Top 0.3: IC1.34 58,6.16 Q1.1
  Bottom 0.3: Q1.1 59,5.16 C2.2
PAR
  Top 0.3: X1.A43 65.41,36.2 64.14,34.92 64.14,33.66 65.41,32.38 65.41,31.11 63,28.71 IC1.82
PERR#
  Top 0.3: X1.B40 61.59,29.09 60,27.5 IC1.88
PME#
  Top 0.3: X1.A19 34.92,42.55 34.29,43.18 RN2.5
PRSNT1#
  Top 0.3: X1.B9 22.23,37.47 23.5,38.73 RN2.2
PRSNT2#
  Top 0.3: X1.B11 24.77,37.47 26.04,38.73 RN2.3
REQ64#
  Top 0.3: X1.A60 87,41.27 85.09,43.18 RN1.5
REQ#
  Top 0.3: X1.B18 33.66,28.84 38.5,24 38.5,21.25 45.25,14.5 IC1.19
RST#
  Top 0.3: X1.A15 29.84,36.2 31.11,34.92 31.11,33.66 29.84,32.38 29.84,30.16 31.26,28.75 31.5,28.75 37,23.25 37,20.5 44.5,13 49,13 50.5,11.5 IC1.25
SBO#
  Top 0.3: X1.A41 62.87,41.91 RN1.3
SDONE
  Top 0.3: X1.A40 RN1.2
SERIF_RXD
  Top 0.3: IC1.45 63.5,6.5 66.5,3.5 68,3.5 68.33,3.17 73.03,3.17 73.66,3.81 SERIF.1
SERIF_TXD  (via drill 0.6)
  Top 0.3: IC1.46 64,6.75 66.75,4 68,4 68.13,4.13 v72.07,4.13
  Bottom 0.3: SERIF.5 78.74,2.54 73.66,2.54 v72.07,4.13
SERIF_XCK
  Top 0.3: IC1.48 65,6.5 67,4.5 67.75,4.5 68.33,5.08 81.28,5.08 SERIF.7
SERR#
  Top 0.3: X1.B42 64.14,30.8 62.25,28.91 62.25,28.75 60.5,27 IC1.87
STOP#
  Top 0.3: X1.A38 59.05,33.66 60.33,32.38 60.33,31.11 59.37,30.16 59.37,28.87 58.5,28 IC1.91
TRDY#
  Top 0.3: X1.A36 56.52,33.66 57.78,32.38 57.78,31.11 57.15,30.48 57.15,28.85 57.5,28.5 IC1.93

### Text on the board
tNames: -12 / 0 / +5 / +12 | DEBUG | ATMEGA / 1280/2560 | 0 / 0 / 0 / +5 / +5 | VREG 1117 | 0 / 3.3 / 5 | RX / 0 / TX / CK / +5 | AVR-PCI bridge v2 / http://penma.de/avrpci | external / power | ISP | SERIAL
bNames: 5V power / open=extern / close=serial